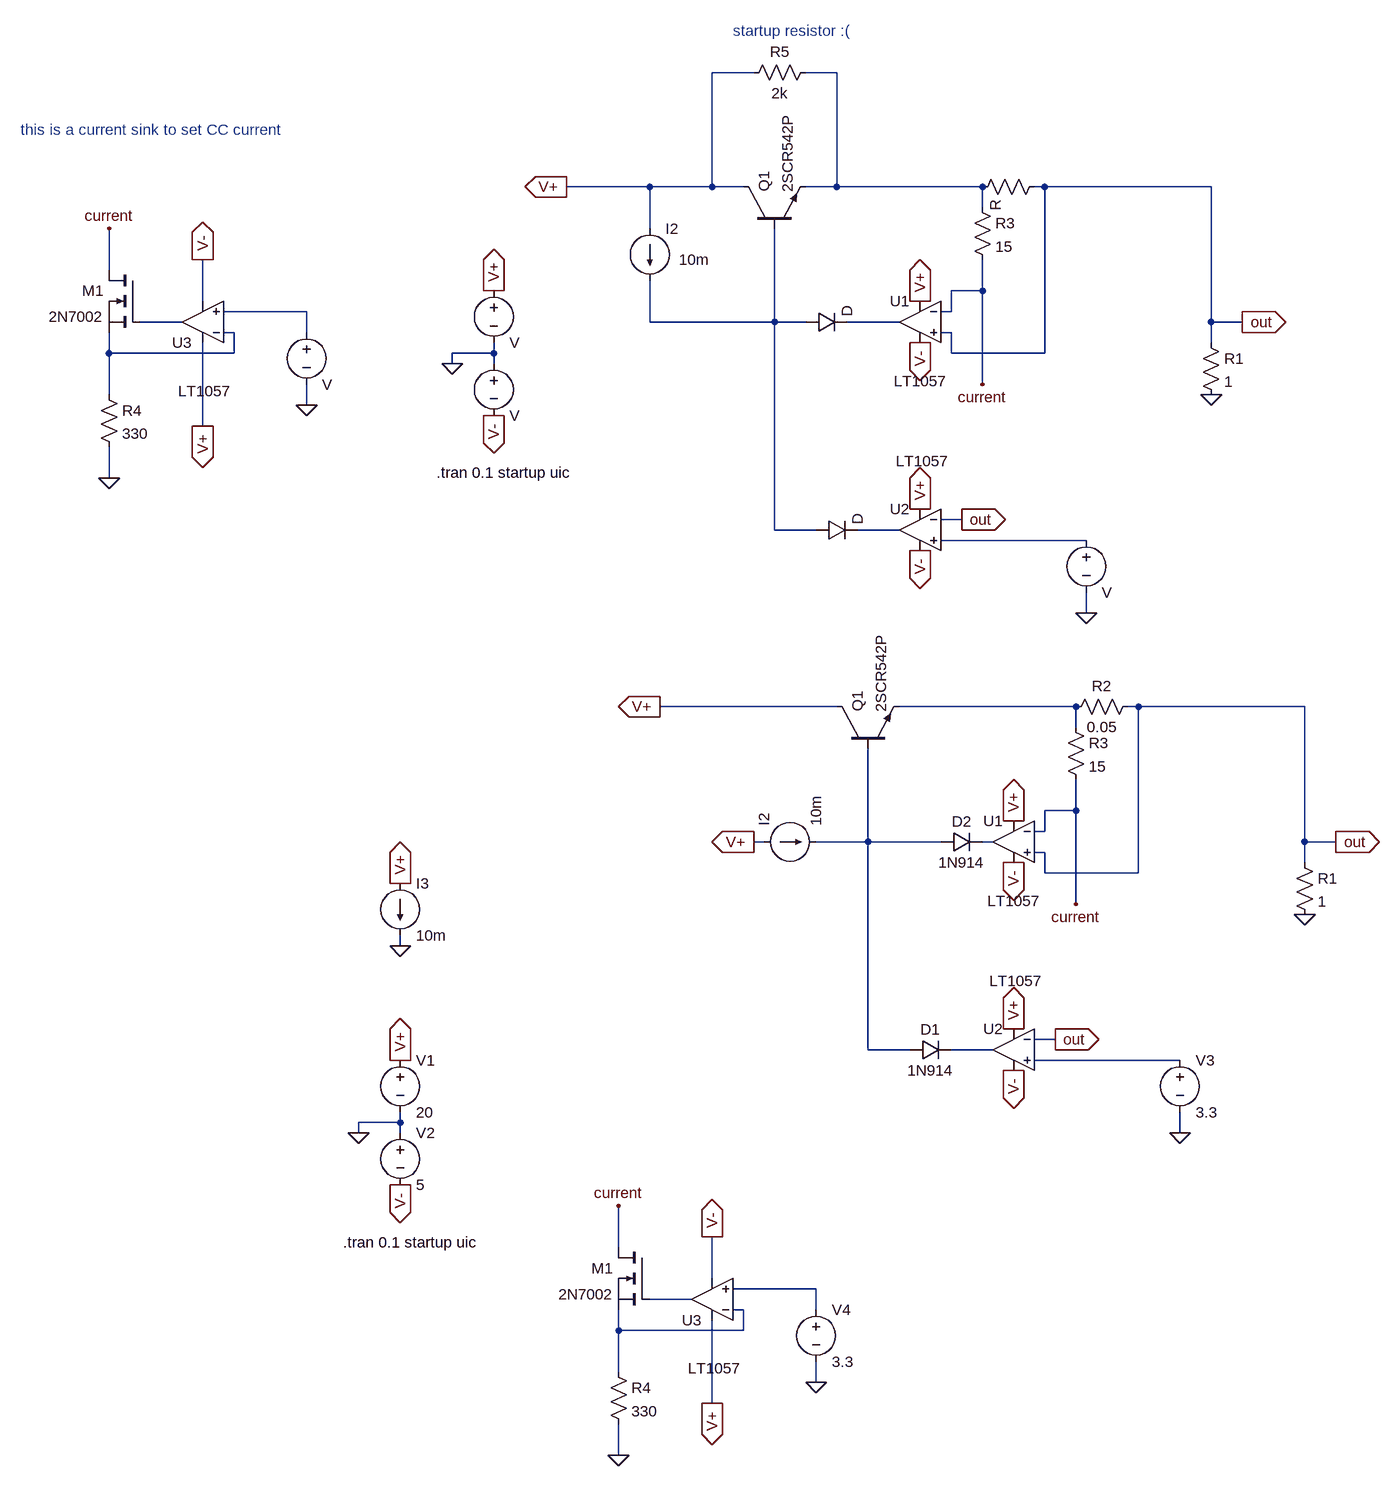
[diagram p0: schematic high_side_current_sense.asc]
high_side_current_sense.asc, the LTspice schematic file:
Version 4
SHEET 1 1748 804
<<<<<<< HEAD
WIRE 560 -1408 496 -1408
WIRE 688 -1408 640 -1408
WIRE 400 -1232 272 -1232
WIRE 496 -1232 496 -1408
WIRE 496 -1232 400 -1232
WIRE 544 -1232 496 -1232
WIRE 688 -1232 688 -1408
WIRE 688 -1232 640 -1232
WIRE 912 -1232 688 -1232
WIRE 1008 -1232 992 -1232
WIRE 1264 -1232 1008 -1232
WIRE 912 -1200 912 -1232
WIRE 400 -1168 400 -1232
WIRE -432 -1104 -432 -1168
WIRE 912 -1072 912 -1120
WIRE 912 -1072 864 -1072
WIRE -288 -1056 -288 -1120
WIRE -128 -1040 -256 -1040
WIRE 864 -1040 864 -1072
WIRE 864 -1040 848 -1040
WIRE -320 -1024 -384 -1024
WIRE 400 -1024 400 -1088
WIRE 592 -1024 592 -1168
WIRE 592 -1024 400 -1024
WIRE 640 -1024 592 -1024
WIRE 784 -1024 704 -1024
WIRE 1264 -1024 1264 -1232
WIRE 1312 -1024 1264 -1024
WIRE -240 -1008 -256 -1008
WIRE -128 -1008 -128 -1040
WIRE 864 -1008 848 -1008
WIRE 1264 -992 1264 -1024
WIRE -432 -976 -432 -1008
WIRE -240 -976 -240 -1008
WIRE -240 -976 -432 -976
WIRE 160 -976 160 -992
WIRE 160 -976 96 -976
WIRE 864 -976 864 -1008
WIRE 1008 -976 1008 -1232
WIRE 1008 -976 864 -976
WIRE 96 -960 96 -976
WIRE 160 -960 160 -976
WIRE 912 -928 912 -1072
WIRE -432 -912 -432 -976
WIRE -128 -896 -128 -928
WIRE -288 -864 -288 -992
WIRE -432 -784 -432 -832
WIRE 880 -720 848 -720
WIRE 592 -704 592 -1024
WIRE 656 -704 592 -704
WIRE 784 -704 720 -704
WIRE 1072 -688 848 -688
WIRE 1072 -576 1072 -608
FLAG 96 -960 0
FLAG 160 -1072 V+
IOPIN 160 -1072 Out
FLAG 816 -736 V+
IOPIN 816 -736 Out
FLAG 160 -880 V-
IOPIN 160 -880 Out
FLAG 816 -672 V-
IOPIN 816 -672 Out
FLAG 1072 -576 0
FLAG 1264 -912 0
FLAG 272 -1232 V+
IOPIN 272 -1232 Out
FLAG 1312 -1024 out
IOPIN 1312 -1024 Out
FLAG 880 -720 out
IOPIN 880 -720 Out
FLAG 816 -1056 V+
IOPIN 816 -1056 Out
FLAG 816 -992 V-
IOPIN 816 -992 Out
FLAG -288 -864 V+
IOPIN -288 -864 Out
FLAG -288 -1120 V-
IOPIN -288 -1120 Out
FLAG -128 -896 0
FLAG -432 -1168 current
FLAG 912 -928 current
FLAG -432 -784 0
SYMBOL voltage 160 -1088 R0
=======
WIRE 688 -432 416 -432
WIRE 1056 -432 784 -432
WIRE 1152 -432 1136 -432
WIRE 1408 -432 1152 -432
WIRE 1056 -400 1056 -432
WIRE 1056 -272 1056 -320
WIRE 1056 -272 1008 -272
WIRE 1008 -240 1008 -272
WIRE 1008 -240 992 -240
WIRE 576 -224 560 -224
WIRE 736 -224 736 -368
WIRE 736 -224 656 -224
WIRE 848 -224 736 -224
WIRE 928 -224 912 -224
WIRE 1408 -224 1408 -432
WIRE 1456 -224 1408 -224
WIRE 1008 -208 992 -208
WIRE 1408 -192 1408 -224
WIRE 1008 -176 1008 -208
WIRE 1152 -176 1152 -432
WIRE 1152 -176 1008 -176
WIRE 1056 -128 1056 -272
WIRE 16 -64 16 -80
WIRE 1024 80 992 80
WIRE 736 96 736 -224
WIRE 800 96 736 96
WIRE 928 96 864 96
WIRE 1216 112 992 112
WIRE 16 208 16 192
WIRE 16 208 -48 208
WIRE -48 224 -48 208
WIRE 16 224 16 208
WIRE 1216 224 1216 192
WIRE 352 400 352 336
WIRE 496 448 496 384
WIRE 656 464 528 464
WIRE 464 480 400 480
WIRE 544 496 528 496
WIRE 656 496 656 464
WIRE 352 528 352 496
WIRE 544 528 544 496
WIRE 544 528 352 528
WIRE 352 592 352 528
WIRE 656 608 656 576
WIRE 496 640 496 512
WIRE 352 720 352 672
FLAG -48 224 0
FLAG 16 112 V+
IOPIN 16 112 Out
FLAG 960 64 V+
IOPIN 960 64 Out
FLAG 16 304 V-
IOPIN 16 304 Out
FLAG 960 128 V-
IOPIN 960 128 Out
FLAG 1216 224 0
FLAG 1408 -112 0
FLAG 416 -432 V+
IOPIN 416 -432 Out
FLAG 1456 -224 out
IOPIN 1456 -224 Out
FLAG 560 -224 V+
IOPIN 560 -224 Out
FLAG 1024 80 out
IOPIN 1024 80 Out
FLAG 960 -256 V+
IOPIN 960 -256 Out
FLAG 960 -192 V-
IOPIN 960 -192 Out
FLAG 496 640 V+
IOPIN 496 640 Out
FLAG 496 384 V-
IOPIN 496 384 Out
FLAG 656 608 0
FLAG 352 336 current
FLAG 16 -64 0
FLAG 16 -160 V+
IOPIN 16 -160 Out
FLAG 1056 -128 current
FLAG 352 720 0
SYMBOL voltage 16 96 R0
>>>>>>> 6c758090dd1eeeb20fed47f8386ac39ac4c47e26
WINDOW 123 0 0 Left 2
WINDOW 39 0 0 Left 2
SYMATTR InstName V1
SYMATTR Value 20
<<<<<<< HEAD
SYMBOL voltage 160 -976 R0
=======
SYMBOL voltage 16 208 R0
>>>>>>> 6c758090dd1eeeb20fed47f8386ac39ac4c47e26
WINDOW 123 0 0 Left 2
WINDOW 39 0 0 Left 2
SYMATTR InstName V2
SYMATTR Value 5
<<<<<<< HEAD
SYMBOL voltage 1072 -704 R0
=======
SYMBOL voltage 1216 96 R0
>>>>>>> 6c758090dd1eeeb20fed47f8386ac39ac4c47e26
WINDOW 123 0 0 Left 2
WINDOW 39 0 0 Left 2
SYMATTR InstName V3
SYMATTR Value 3.3
<<<<<<< HEAD
SYMBOL npn 544 -1168 R270
SYMATTR InstName Q1
SYMATTR Value 2SCR542P
SYMBOL res 1248 -1008 R0
SYMATTR InstName R1
SYMATTR Value 1
SYMBOL res 1008 -1248 R90
=======
SYMBOL npn 688 -368 R270
SYMATTR InstName Q1
SYMATTR Value 2SCR542P
SYMBOL res 1392 -208 R0
SYMATTR InstName R1
SYMATTR Value 1
SYMBOL res 1152 -448 R90
>>>>>>> 6c758090dd1eeeb20fed47f8386ac39ac4c47e26
WINDOW 0 0 56 VBottom 2
WINDOW 3 32 56 VTop 2
SYMATTR InstName R2
SYMATTR Value 0.05
<<<<<<< HEAD
SYMBOL res 896 -1216 R0
SYMATTR InstName R3
SYMATTR Value 15
SYMBOL Opamps\\LT1057 816 -768 M0
WINDOW 3 -45 -42 Left 2
SYMATTR InstName U2
SYMBOL current 400 -1168 R0
WINDOW 123 0 0 Left 2
WINDOW 39 0 0 Left 2
WINDOW 3 45 48 Left 2
SYMATTR Value 10m
SYMATTR InstName I2
SYMBOL diode 656 -688 R270
=======
SYMBOL res 1040 -416 R0
SYMATTR InstName R3
SYMATTR Value 15
SYMBOL Opamps\\LT1057 960 32 M0
WINDOW 3 -45 -42 Left 2
SYMATTR InstName U2
SYMBOL current 576 -224 R270
WINDOW 123 0 0 Left 2
WINDOW 39 0 0 Left 2
SYMATTR InstName I2
SYMATTR Value 10m
SYMBOL diode 800 112 R270
>>>>>>> 6c758090dd1eeeb20fed47f8386ac39ac4c47e26
WINDOW 0 32 32 VTop 2
WINDOW 3 0 32 VBottom 2
SYMATTR InstName D1
SYMATTR Value 1N914
<<<<<<< HEAD
SYMBOL Opamps\\LT1057 816 -1088 M0
WINDOW 3 -42 155 Left 2
SYMATTR InstName U1
SYMBOL diode 640 -1008 R270
=======
SYMBOL Opamps\\LT1057 960 -288 M0
WINDOW 3 -42 155 Left 2
SYMATTR InstName U1
SYMBOL diode 848 -208 R270
>>>>>>> 6c758090dd1eeeb20fed47f8386ac39ac4c47e26
WINDOW 0 32 32 VTop 2
WINDOW 3 0 32 VBottom 2
SYMATTR InstName D2
SYMATTR Value 1N914
<<<<<<< HEAD
SYMBOL Opamps\\LT1057 -288 -960 R180
WINDOW 3 -45 -42 Left 2
SYMATTR InstName U3
SYMBOL voltage -128 -1024 R0
=======
SYMBOL Opamps\\LT1057 496 544 R180
WINDOW 3 -45 -42 Left 2
SYMATTR InstName U3
SYMBOL voltage 656 480 R0
>>>>>>> 6c758090dd1eeeb20fed47f8386ac39ac4c47e26
WINDOW 123 0 0 Left 2
WINDOW 39 0 0 Left 2
SYMATTR InstName V4
SYMATTR Value 3.3
<<<<<<< HEAD
SYMBOL res -448 -928 R0
SYMATTR InstName R4
SYMATTR Value 330
SYMBOL nmos -384 -1104 M0
SYMATTR InstName M1
SYMATTR Value 2N7002
SYMBOL res 656 -1424 R90
WINDOW 0 0 56 VBottom 2
WINDOW 3 32 56 VTop 2
SYMATTR InstName R5
SYMATTR Value 2k
TEXT 72 -792 Left 2 !.tran 0.1 startup uic
TEXT 528 -1472 Left 2 ;startup resistor :(
TEXT -568 -1320 Left 2 ;this is a current sink to set CC current
=======
SYMBOL res 336 576 R0
SYMATTR InstName R4
SYMATTR Value 330
SYMBOL nmos 400 400 M0
SYMATTR InstName M1
SYMATTR Value 2N7002
SYMBOL current 16 -160 R0
WINDOW 123 0 0 Left 2
WINDOW 39 0 0 Left 2
SYMATTR InstName I3
SYMATTR Value 10m
TEXT -72 392 Left 2 !.tran 0.1 startup uic
>>>>>>> 6c758090dd1eeeb20fed47f8386ac39ac4c47e26

The netlist it stands for:
* high_side_current_sense.asc
V§? V+ 0 V
V1 V+ 0 20
V§? 0 V- V
V2 0 V- 5
V§? N008 0 V
V3 N013 0 3.3
Q1 V+ N004 N001 0 2SCR542P
R1 out 0 1
R§? out N001 R
Q1 V+ N010 N009 0 2SCR542P
R1 out 0 1
R2 out N009 0.05
R3 N001 current 15
XU2 N008 out V+ V- N007 LT1057  ; pins In+ In- V+ V- OUT
I2 V+ N004 10m
D§? N004 N007 D
R3 N009 current 15
XU2 N013 out V+ V- N012 LT1057  ; pins In+ In- V+ V- OUT
I2 V+ N010 10m
D1 N010 N012 1N914
XU1 out current V+ V- N005 LT1057  ; pins In+ In- V+ V- OUT
D§? N004 N005 D
XU1 out current V+ V- N011 LT1057  ; pins In+ In- V+ V- OUT
D2 N010 N011 1N914
XU3 N002 N006 V+ V- N003 LT1057  ; pins In+ In- V+ V- OUT
V§? N002 0 V
XU3 N014 N016 V+ V- N015 LT1057  ; pins In+ In- V+ V- OUT
V4 N014 0 3.3
R4 N006 0 330
M1 current N003 N006 N006 2N7002
R5 N001 V+ 2k
R4 N016 0 330
M1 current N015 N016 N016 2N7002
I3 V+ 0 10m
.model D D
.lib standard.dio
.model NPN NPN
.model PNP PNP
.lib standard.bjt
.model NMOS NMOS
.model PMOS PMOS
.lib standard.mos
.tran 0.1 startup uic
* startup resistor :(
* this is a current sink to set CC current
.tran 0.1 startup uic
.lib LTC.lib
.backanno
.end